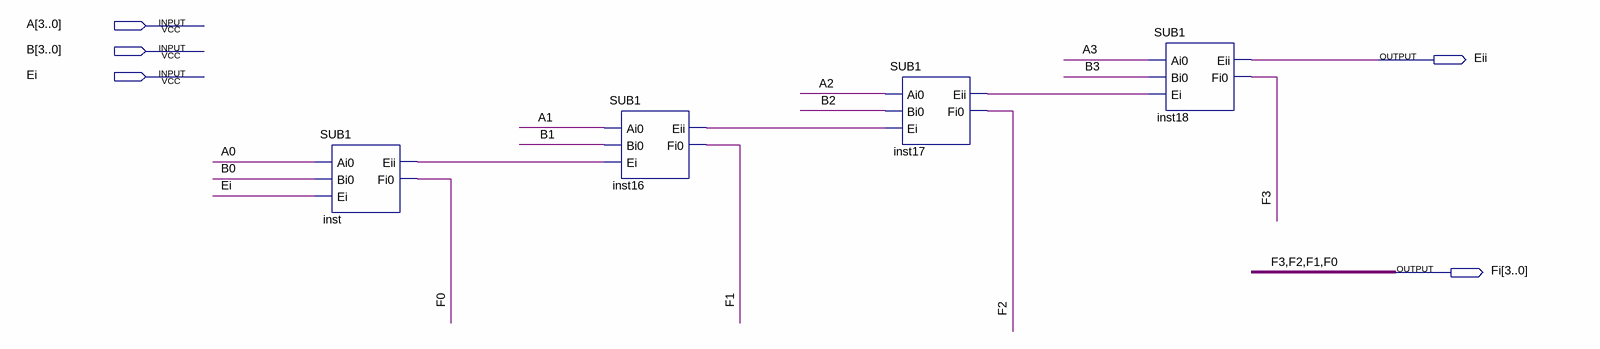
[diagram p0: schematic sheet]
// Quartus schematic SUB4.bdf as structural Verilog: 4 symbols, 5 pins
module SUB4 (
  input  [3:0] A,
  input  [3:0] B,
  input  Ei,
  output Eii,
  output [3:0] Fi
);

  wire inst16_eii, inst17_eii, inst_eii;

  SUB1 inst (.Ai0(A[0]), .Bi0(B[0]), .Ei(Ei), .Eii(inst_eii), .Fi0(Fi[0]));
  SUB1 inst16 (.Ai0(A[1]), .Bi0(B[1]), .Ei(inst_eii), .Eii(inst16_eii), .Fi0(Fi[1]));
  SUB1 inst17 (.Ai0(A[2]), .Bi0(B[2]), .Ei(inst16_eii), .Eii(inst17_eii), .Fi0(Fi[2]));
  SUB1 inst18 (.Ai0(A[3]), .Bi0(B[3]), .Ei(inst17_eii), .Eii(Eii), .Fi0(Fi[3]));

  // Other names for the same wires on the sheet: F0 = Fi[0]; F1 = Fi[1]; F2 = Fi[2]; F3 = Fi[3]
endmodule
